# Altium project USB 3.1_to_Gigabit_Ethernet_Adapter_Hardware_Design_V1.0.PrjPcb (part 1 of 3)
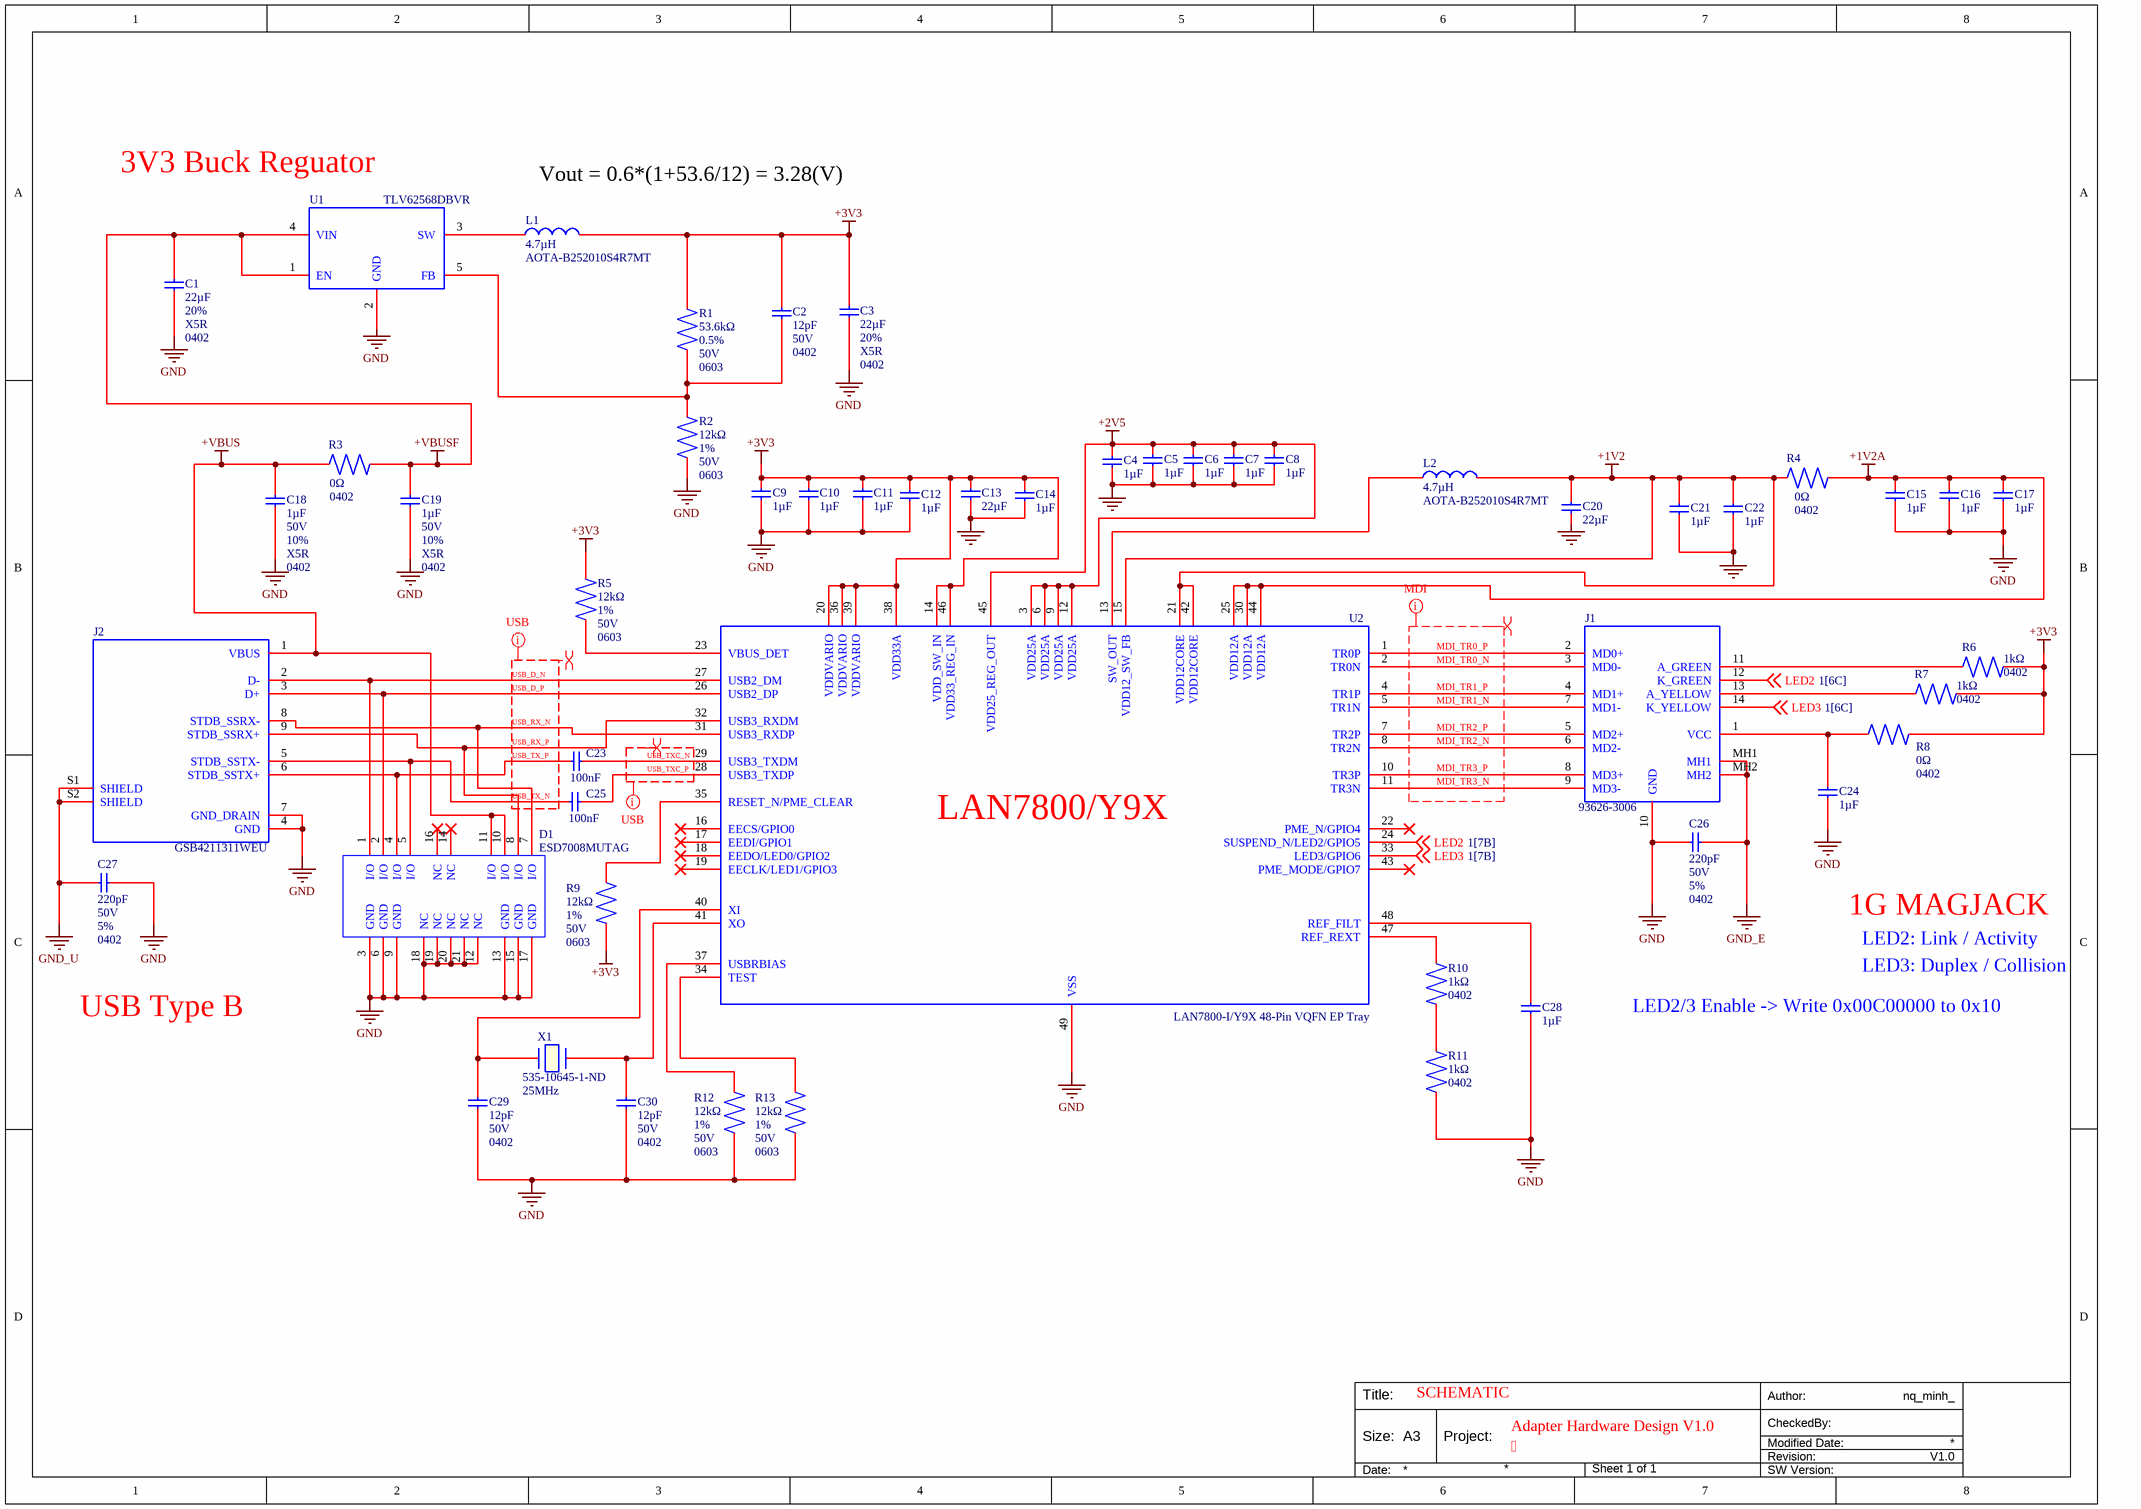
[diagram p0: Schematic.SchDoc]
1 sheet, 51 parts. Net scope: global (net labels, ports and power ports of the same name join across sheets).
Board file: PCB_V1.0.PcbDoc

## Sheet Schematic.SchDoc
size A3; Author: nq_minh_; Organization: My Company; Address1: Address Line 1; Address2: Address Line 2; Address3: Address Line 3; Address4: Address Line 4; Revision: V1.0; SheetNumber: 1; SheetTotal: 1

### Parts
C1  22µF  Tolerance: 20%  Dielectric: X5R  Case/Package: 0402  [C0402]
C2  12pF  Voltage Rating: 50V  Case/Package: 0402  [C0402]
C3  22µF  Tolerance: 20%  Dielectric: X5R  Case/Package: 0402  [C0402]
C4  1µF  [C0402]
C5  1µF  [C0402]
C6  1µF  [C0402]
C7  1µF  [C0402]
C8  1µF  [C0402]
C9  1µF  [C0402]
C10  1µF  [C0402]
C11  1µF  [C0402]
C12  1µF  [C0402]
C13  22µF  [C0402]
C14  1µF  [C0402]
C15  1µF  [C0402]
C16  1µF  [C0402]
C17  1µF  [C0402]
C18  1µF  Voltage Rating: 50V  Tolerance: 10%  Dielectric: X5R  Case/Package: 0402  [C0402]
C19  1µF  Voltage Rating: 50V  Tolerance: 10%  Dielectric: X5R  Case/Package: 0402  [C0402]
C20  22µF  [C0402]
C21  1µF  [C0402]
C22  1µF  [C0402]
C23  100nF  [C0402]
C24  1µF  [C0402]
C25  100nF  [C0402]
C26  220pF  Voltage: 50V  Tolerance: 5%  Case/Package: 0402  [C0402]
C27  220pF  Voltage: 50V  Tolerance: 5%  Case/Package: 0402  [C0402]
C28  1µF  [C0402]
C29  12pF  Voltage Rating: 50V  Case/Package: 0402  [C0402]
C30  12pF  Voltage Rating: 50V  Case/Package: 0402  [C0402]
D1  ESD7008MUTAG  [ESD7008MUTAG]
J1  93626-3006  [936263006]
J2  GSB4211311WEU  [AMPHENOL_GSB4211311WEU]
L1  4.7µH  [INDC2520X100N]
L2  4.7µH  [INDC2520X100N]
R1  53.6kΩ  Tolerance: 0.5%  Voltage Rating (DC): 50V  Case/Package: 0603  [RESC1608X55N]
R2  12kΩ  Tolerance: 1%  Voltage Rating: 50V  Case/Package: 0603  [RC0603N_YAG-L]
R3  0Ω  Case/Package: 0402  [RC0402N_YAG-L]
R4  0Ω  Case/Package: 0402  [RC0402N_YAG-L]
R5  12kΩ  Tolerance: 1%  Voltage Rating: 50V  Case/Package: 0603  [RC0603N_YAG-L]
R6  1kΩ  Case/Package: 0402  [RC0402N_YAG-L]
R7  1kΩ  Case/Package: 0402  [RC0402N_YAG-L]
R8  0Ω  Case/Package: 0402  [RC0402N_YAG-L]
R9  12kΩ  Tolerance: 1%  Voltage Rating: 50V  Case/Package: 0603  [RC0603N_YAG-L]
R10  1kΩ  Case/Package: 0402  [RC0402N_YAG-L]
R11  1kΩ  Case/Package: 0402  [RC0402N_YAG-L]
R12  12kΩ  Tolerance: 1%  Voltage Rating: 50V  Case/Package: 0603  [RC0603N_YAG-L]
R13  12kΩ  Tolerance: 1%  Voltage Rating: 50V  Case/Package: 0603  [RC0603N_YAG-L]
U1  TLV62568DBVR  [SOT95P280X145-5N]
U2  LAN7800-I/Y9X 48-Pin VQFN EP Tray  [SQFN48_7X7_Y9X_MCH-L]
X1  Supplier Part Number: 535-10645-1-ND  Frequency: 25MHz  [XTAL_ABM3_ABR-L]  (hidden comment: ABM3-25.000MHZ-D2Y-T 25Mhz)

### Nets
+1V2: C20.2 C21.1 C22.1 L2.2 R4.1 U2.15(VDD12_SW_FB) U2.21(VDD12CORE) U2.42(VDD12CORE)
+1V2A: C15.1 C16.1 C17.1 R4.2 U2.25(VDD12A) U2.30(VDD12A) U2.44(VDD12A)
+2V5: C4.1 C5.2 C6.2 C7.2 C8.2 U2.3(VDD25A) U2.6(VDD25A) U2.9(VDD25A) U2.12(VDD25A) U2.45(VDD25_REG_OUT)
+3V3: C2.2 C3.2 C9.1 C10.1 C11.1 C12.1 C13.2 C14.1 L1.2 R1.2 R5.2 R6.2 R7.2 R8.2 R9.2 U2.14(VDD_SW_IN) U2.20(VDDVARIO) U2.36(VDDVARIO) U2.38(VDD33A) U2.39(VDDVARIO) U2.46(VDD33_REG_IN)
+VBUS: C18.2 D1.10(I/O) D1.11(I/O) J2.1(VBUS) R3.1
+VBUSF: C1.2 C19.2 R3.2 U1.1(EN) U1.4(VIN)
GND: C1.1 C3.1 C4.2 C5.1 C6.1 C7.1 C8.1 C9.2 C10.2 C11.2 C12.2 C13.1 C14.2 C15.2 C16.2 C17.2 C18.1 C19.1 C20.1 C21.2 C22.2 C24.2 C26.1 C27.1 C28.2 C29.1 C30.1 D1.3(GND) D1.6(GND) D1.9(GND) D1.12(NC) D1.13(GND) D1.15(GND) D1.17(GND) D1.18(NC) D1.19(NC) D1.20(NC) D1.21(NC) J1.10(GND) J2.4(GND) J2.7(GND_DRAIN) R2.1 R11.1 R12.2 R13.2 U1.2(GND) U2.49(VSS)
GND_E: C26.2 J1.MH1 J1.MH2
GND_U: C27.2 J2.S1(SHIELD) J2.S2(SHIELD)
LED2: J1.12(K_GREEN) U2.24(SUSPEND_N/LED2/GPIO5) ; off-sheet LED2
LED3: J1.14(K_YELLOW) U2.33(LED3/GPIO6) ; off-sheet LED3
MDI_TR0_N: J1.3(MD0-) U2.2(TR0N)
MDI_TR0_P: J1.2(MD0+) U2.1(TR0P)
MDI_TR1_N: J1.7(MD1-) U2.5(TR1N)
MDI_TR1_P: J1.4(MD1+) U2.4(TR1P)
MDI_TR2_N: J1.6(MD2-) U2.8(TR2N)
MDI_TR2_P: J1.5(MD2+) U2.7(TR2P)
MDI_TR3_N: J1.9(MD3-) U2.11(TR3N)
MDI_TR3_P: J1.8(MD3+) U2.10(TR3P)
USB_D_N: D1.1(I/O) J2.2(D-) U2.27(USB2_DM)
USB_D_P: D1.2(I/O) J2.3(D+) U2.26(USB2_DP)
USB_RX_N: D1.7(I/O) J2.8(STDB_SSRX-) U2.31(USB3_RXDP)
USB_RX_P: D1.8(I/O) J2.9(STDB_SSRX+) U2.32(USB3_RXDM)
USB_TX_N: C25.1 D1.5(I/O) J2.5(STDB_SSTX-)
USB_TX_P: C23.1 D1.4(I/O) J2.6(STDB_SSTX+)
USB_TXC_N: C23.2 U2.29(USB3_TXDM)
USB_TXC_P: C25.2 U2.28(USB3_TXDP)
NetC2_1: C2.1 R1.1 R2.2 U1.5(FB)
NetC24_1: C24.1 J1.1(VCC) R8.1
NetC28_1: C28.1 U2.48(REF_FILT)
NetC29_2: C29.2 U2.40(XI) X1.1
NetC30_2: C30.2 U2.41(XO) X1.2
NetJ1_11: J1.11(A_GREEN) R6.1
NetJ1_13: J1.13(A_YELLOW) R7.1
NetL1_1: L1.1 U1.3(SW)
NetL2_1: L2.1 U2.13(SW_OUT)
NetR5_1: R5.1 U2.23(VBUS_DET)
NetR9_1: R9.1 U2.35(RESET_N/PME_CLEAR)
NetR10_1: R10.1 R11.2
NetR10_2: R10.2 U2.47(REF_REXT)
NetR12_1: R12.1 U2.37(USBRBIAS)
NetR13_1: R13.1 U2.34(TEST)

Not connected (* = marked no-connect by the designer): D1 14(NC)* 16(NC)*; U2 16(EECS/GPIO0)* 17(EEDI/GPIO1)* 18(EEDO/LED0/GPIO2)* 19(EECLK/LED1/GPIO3)* 22(PME_N/GPIO4)* 43(PME_MODE/GPIO7)*

### Layout directives
mark named USB: USB_D_N, USB_D_P, USB_RX_N, USB_RX_P, USB_TX_N, USB_TX_P, USB_TXC_N, USB_TXC_P
differential pair; differential pair class Diff_50: USB_D_N, USB_D_P, USB_RX_N, USB_RX_P, USB_TX_N, USB_TX_P, USB_TXC_N, USB_TXC_P
mark named MDI: MDI_TR0_N, MDI_TR0_P, MDI_TR1_N, MDI_TR1_P, MDI_TR2_N, MDI_TR2_P, MDI_TR3_N, MDI_TR3_P
differential pair; differential pair class Diff_100: MDI_TR0_N, MDI_TR0_P, MDI_TR1_N, MDI_TR1_P, MDI_TR2_N, MDI_TR2_P, MDI_TR3_N, MDI_TR3_P

### Notes on the sheet
- 3V3 Buck Reguator
- (near L1) Vout = 0.6*(1+53.6/12) = 3.28(V)
- 1G MAGJACK
- LED2: Link / Activity
- LED3: Duplex / Collision
- USB Type B
- LED2/3 Enable -> Write 0x00C00000 to 0x10
- SCHEMATIC
- 
- Adapter Hardware Design V1.0
- Author:
- Title:
- Size:
- A3
- Project:
- Revision:
- Modified Date:
- CheckedBy:
- Date:
- SW Version:
- (in symbol LAN7800-I/Y9X) LAN7800/Y9X